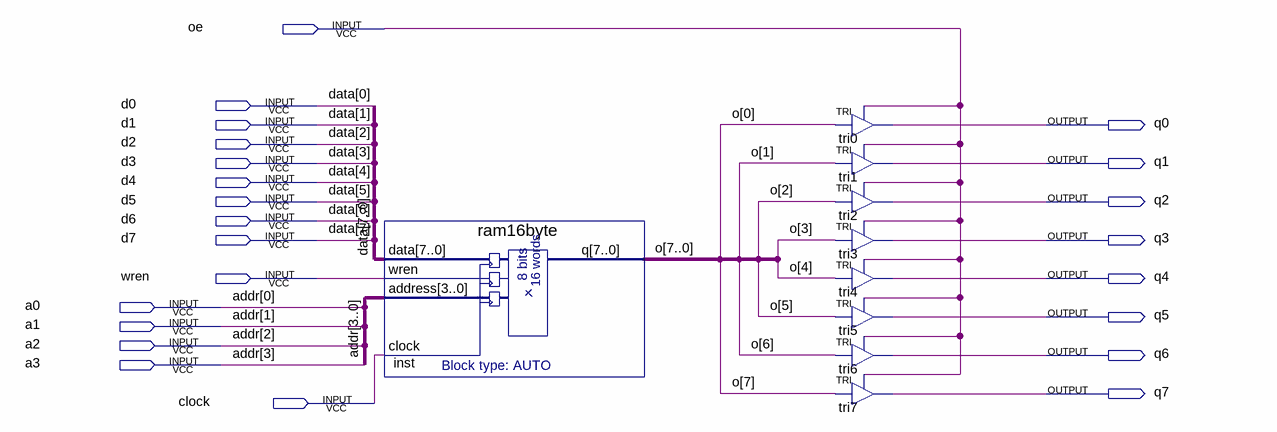
[diagram p0: schematic sheet]
// Quartus schematic ram16bouten.bdf as structural Verilog: 9 symbols, 23 pins
module ram16bouten (
  input  oe,
  input  d0,
  input  d1,
  input  d2,
  input  d3,
  input  d4,
  input  d5,
  input  d6,
  input  d7,
  input  wren,
  input  a0,
  input  a1,
  input  a2,
  input  a3,
  input  clock,
  output q0,
  output q1,
  output q2,
  output q3,
  output q4,
  output q5,
  output q6,
  output q7
);

  wire [7:0] o;

  ram16byte inst (
    .data({d7, d6, d5, d4, d3, d2, d1, d0}), .wren(wren), .address({a3, a2, a1, a0}), .clock(clock), .q(o));
  TRI \tri0  (.IN(o[0]), .OE(oe), .OUT(q0));
  TRI \tri1  (.IN(o[1]), .OE(oe), .OUT(q1));
  TRI tri2 (.IN(o[2]), .OE(oe), .OUT(q2));
  TRI tri3 (.IN(o[3]), .OE(oe), .OUT(q3));
  TRI tri4 (.IN(o[4]), .OE(oe), .OUT(q4));
  TRI tri5 (.IN(o[5]), .OE(oe), .OUT(q5));
  TRI tri6 (.IN(o[6]), .OE(oe), .OUT(q6));
  TRI tri7 (.IN(o[7]), .OE(oe), .OUT(q7));

  // Other names for the same wires on the sheet: addr[3:0] = {a3, a2, a1, a0};
  //   data[7:0] = {d7, d6, d5, d4, d3, d2, d1, d0}
endmodule
